# EAGLE design Sensor_HallArray (EAGLE 9.2.1)
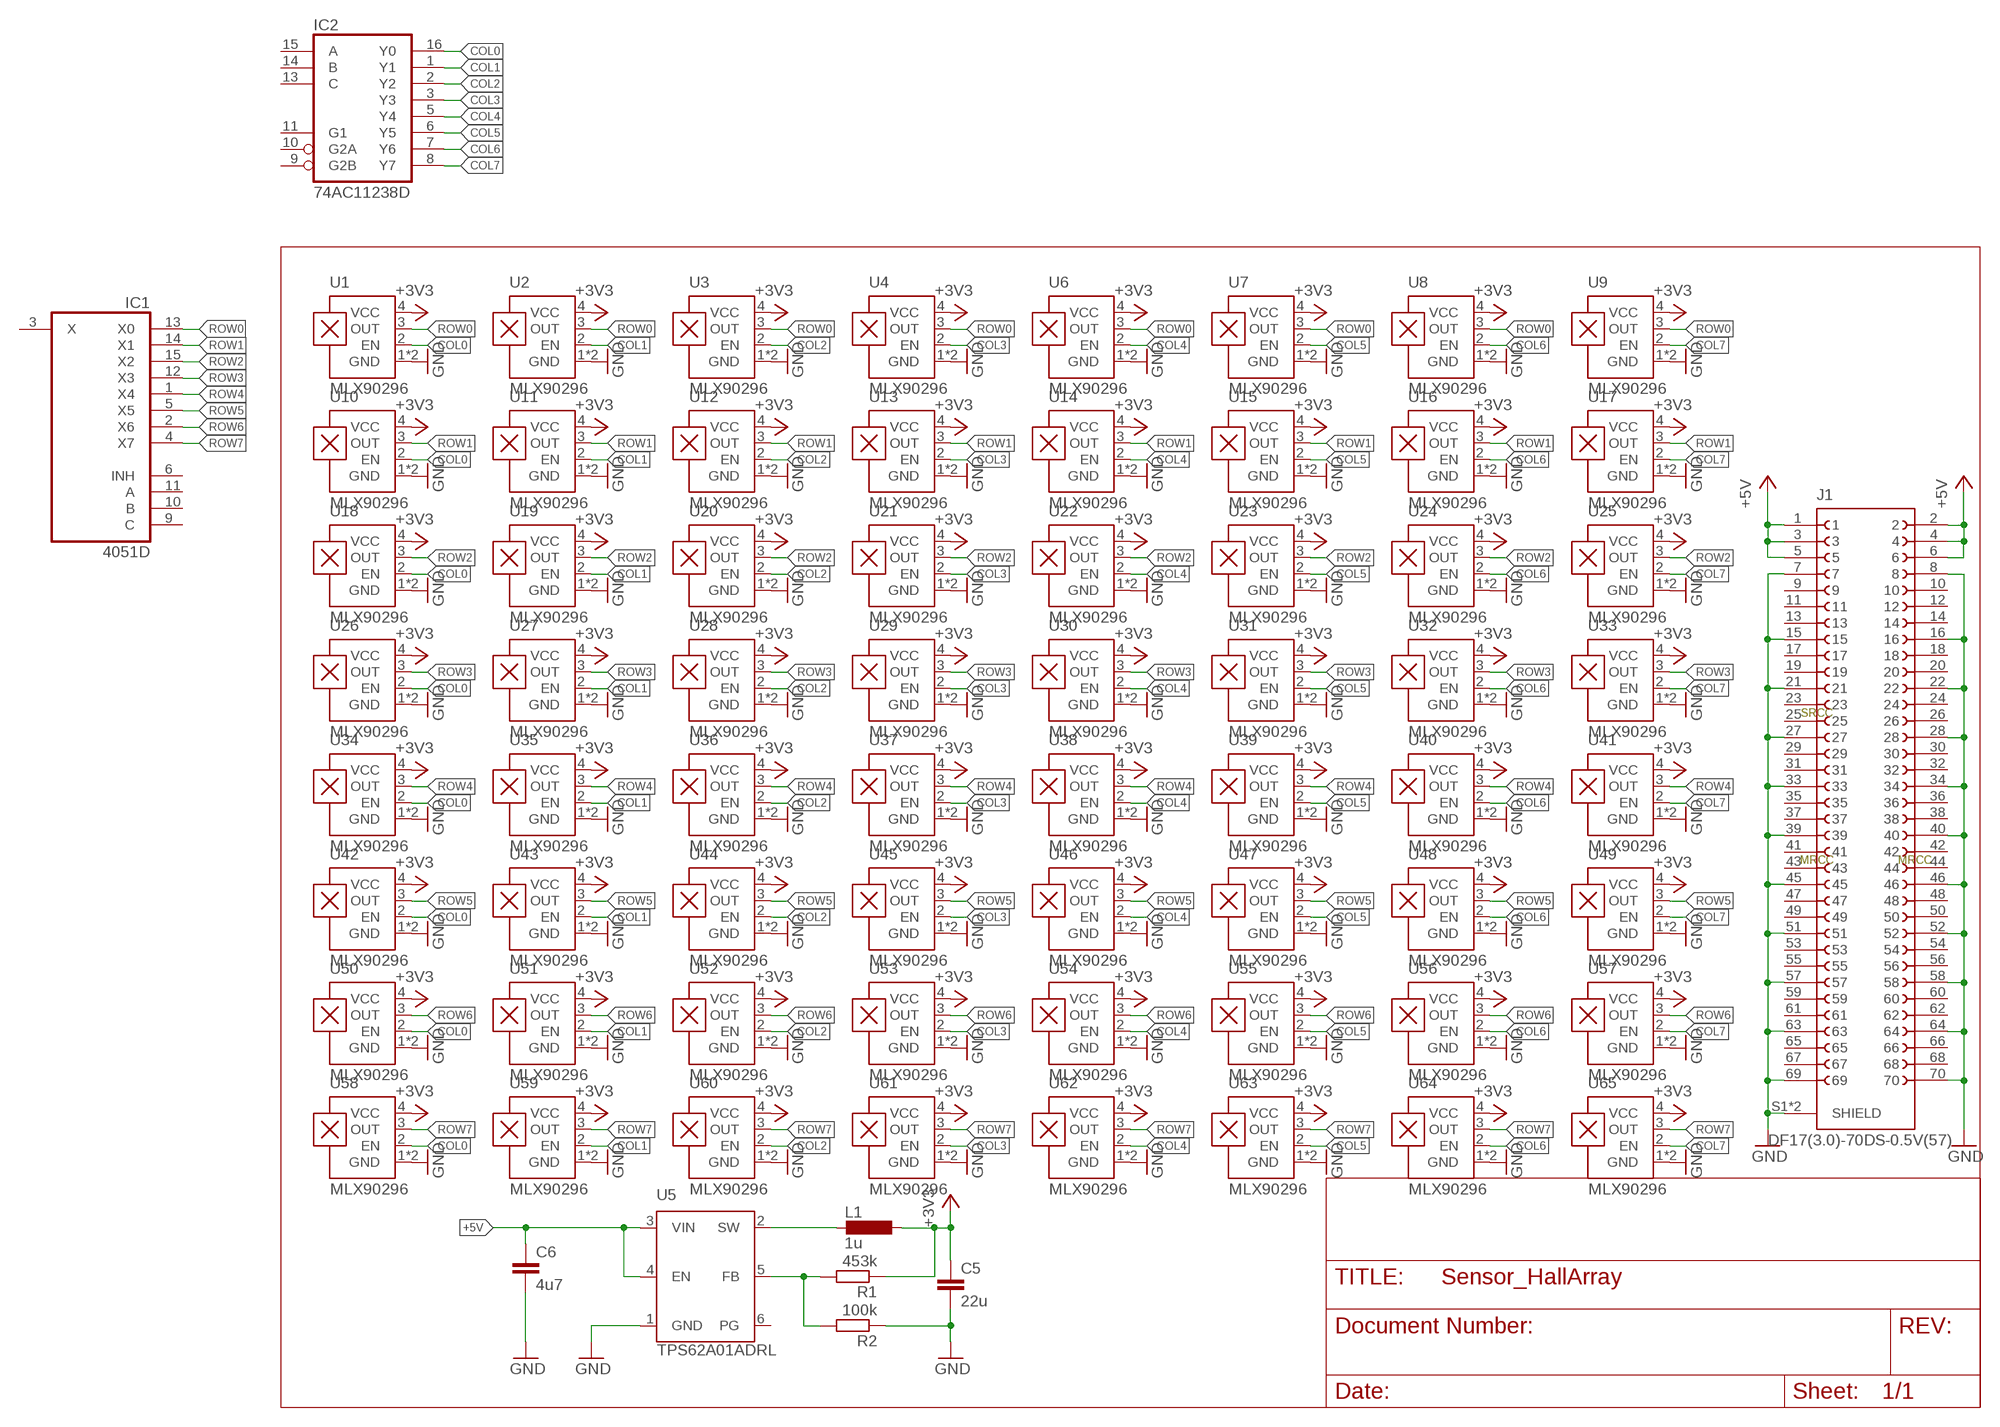
[diagram p0: schematic, sheet 1]

## Parts
C5  22u  C-EUC0603  [C0603]
C6  4u7  C-EUC0603  [C0603]
IC1  4051D  [SO16]
IC2  74AC11238D  [SO16]
J1  DF17(3.0)-70DS-0.5V(57)  [DF17(3.0)-70DS-0.5V(57)]
L1  1u  L-EU1008  [L1008]
R1  453k  R-EU_R0402  [R0402]
R2  100k  R-EU_R0402  [R0402]
U1  MLX90296  [DFN120X160X40-4]
U2  MLX90296  [DFN120X160X40-4]
U3  MLX90296  [DFN120X160X40-4]
U4  MLX90296  [DFN120X160X40-4]
U5  TPS62A01ADRL  [SOTFL50P160X60-6N]
U6  MLX90296  [DFN120X160X40-4]
U7  MLX90296  [DFN120X160X40-4]
U8  MLX90296  [DFN120X160X40-4]
U9  MLX90296  [DFN120X160X40-4]
U10  MLX90296  [DFN120X160X40-4]
U11  MLX90296  [DFN120X160X40-4]
U12  MLX90296  [DFN120X160X40-4]
U13  MLX90296  [DFN120X160X40-4]
U14  MLX90296  [DFN120X160X40-4]
U15  MLX90296  [DFN120X160X40-4]
U16  MLX90296  [DFN120X160X40-4]
U17  MLX90296  [DFN120X160X40-4]
U18  MLX90296  [DFN120X160X40-4]
U19  MLX90296  [DFN120X160X40-4]
U20  MLX90296  [DFN120X160X40-4]
U21  MLX90296  [DFN120X160X40-4]
U22  MLX90296  [DFN120X160X40-4]
U23  MLX90296  [DFN120X160X40-4]
U24  MLX90296  [DFN120X160X40-4]
U25  MLX90296  [DFN120X160X40-4]
U26  MLX90296  [DFN120X160X40-4]
U27  MLX90296  [DFN120X160X40-4]
U28  MLX90296  [DFN120X160X40-4]
U29  MLX90296  [DFN120X160X40-4]
U30  MLX90296  [DFN120X160X40-4]
U31  MLX90296  [DFN120X160X40-4]
U32  MLX90296  [DFN120X160X40-4]
U33  MLX90296  [DFN120X160X40-4]
U34  MLX90296  [DFN120X160X40-4]
U35  MLX90296  [DFN120X160X40-4]
U36  MLX90296  [DFN120X160X40-4]
U37  MLX90296  [DFN120X160X40-4]
U38  MLX90296  [DFN120X160X40-4]
U39  MLX90296  [DFN120X160X40-4]
U40  MLX90296  [DFN120X160X40-4]
U41  MLX90296  [DFN120X160X40-4]
U42  MLX90296  [DFN120X160X40-4]
U43  MLX90296  [DFN120X160X40-4]
U44  MLX90296  [DFN120X160X40-4]
U45  MLX90296  [DFN120X160X40-4]
U46  MLX90296  [DFN120X160X40-4]
U47  MLX90296  [DFN120X160X40-4]
U48  MLX90296  [DFN120X160X40-4]
U49  MLX90296  [DFN120X160X40-4]
U50  MLX90296  [DFN120X160X40-4]
U51  MLX90296  [DFN120X160X40-4]
U52  MLX90296  [DFN120X160X40-4]
U53  MLX90296  [DFN120X160X40-4]
U54  MLX90296  [DFN120X160X40-4]
U55  MLX90296  [DFN120X160X40-4]
U56  MLX90296  [DFN120X160X40-4]
U57  MLX90296  [DFN120X160X40-4]
U58  MLX90296  [DFN120X160X40-4]
U59  MLX90296  [DFN120X160X40-4]
U60  MLX90296  [DFN120X160X40-4]
U61  MLX90296  [DFN120X160X40-4]
U62  MLX90296  [DFN120X160X40-4]
U63  MLX90296  [DFN120X160X40-4]
U64  MLX90296  [DFN120X160X40-4]
U65  MLX90296  [DFN120X160X40-4]

## Nets
+3V3: C5.1 L1.1 R1.1 U1.4(VCC) U2.4(VCC) U3.4(VCC) U4.4(VCC) U6.4(VCC) U7.4(VCC) U8.4(VCC) U9.4(VCC) U10.4(VCC) U11.4(VCC) U12.4(VCC) U13.4(VCC) U14.4(VCC) U15.4(VCC) U16.4(VCC) U17.4(VCC) U18.4(VCC) U19.4(VCC) U20.4(VCC) U21.4(VCC) U22.4(VCC) U23.4(VCC) U24.4(VCC) U25.4(VCC) U26.4(VCC) U27.4(VCC) U28.4(VCC) U29.4(VCC) U30.4(VCC) U31.4(VCC) U32.4(VCC) U33.4(VCC) U34.4(VCC) U35.4(VCC) U36.4(VCC) U37.4(VCC) U38.4(VCC) U39.4(VCC) U40.4(VCC) U41.4(VCC) U42.4(VCC) U43.4(VCC) U44.4(VCC) U45.4(VCC) U46.4(VCC) U47.4(VCC) U48.4(VCC) U49.4(VCC) U50.4(VCC) U51.4(VCC) U52.4(VCC) U53.4(VCC) U54.4(VCC) U55.4(VCC) U56.4(VCC) U57.4(VCC) U58.4(VCC) U59.4(VCC) U60.4(VCC) U61.4(VCC) U62.4(VCC) U63.4(VCC) U64.4(VCC) U65.4(VCC)
+5V: C6.1 J1.1 J1.2 J1.3 J1.4 J1.5 J1.6 U5.3(VIN) U5.4(EN)
COL0: IC2.16(Y0) U1.2(EN) U10.2(EN) U18.2(EN) U26.2(EN) U34.2(EN) U42.2(EN) U50.2(EN) U58.2(EN)
COL1: IC2.1(Y1) U2.2(EN) U11.2(EN) U19.2(EN) U27.2(EN) U35.2(EN) U43.2(EN) U51.2(EN) U59.2(EN)
COL2: IC2.2(Y2) U3.2(EN) U12.2(EN) U20.2(EN) U28.2(EN) U36.2(EN) U44.2(EN) U52.2(EN) U60.2(EN)
COL3: IC2.3(Y3) U4.2(EN) U13.2(EN) U21.2(EN) U29.2(EN) U37.2(EN) U45.2(EN) U53.2(EN) U61.2(EN)
COL4: IC2.5(Y4) U6.2(EN) U14.2(EN) U22.2(EN) U30.2(EN) U38.2(EN) U46.2(EN) U54.2(EN) U62.2(EN)
COL5: IC2.6(Y5) U7.2(EN) U15.2(EN) U23.2(EN) U31.2(EN) U39.2(EN) U47.2(EN) U55.2(EN) U63.2(EN)
COL6: IC2.7(Y6) U8.2(EN) U16.2(EN) U24.2(EN) U32.2(EN) U40.2(EN) U48.2(EN) U56.2(EN) U64.2(EN)
COL7: IC2.8(Y7) U9.2(EN) U17.2(EN) U25.2(EN) U33.2(EN) U41.2(EN) U49.2(EN) U57.2(EN) U65.2(EN)
GND: C5.2 C6.2 J1.7 J1.8 J1.15 J1.16 J1.21 J1.22 J1.27 J1.28 J1.33 J1.34 J1.39 J1.40 J1.45 J1.46 J1.51 J1.52 J1.57 J1.58 J1.63 J1.64 J1.69 J1.70 J1.S1(SHIELD) J1.S2(SHIELD) R2.1 U1.1(GND) U1.E(GND) U2.1(GND) U2.E(GND) U3.1(GND) U3.E(GND) U4.1(GND) U4.E(GND) U5.1(GND) U6.1(GND) U6.E(GND) U7.1(GND) U7.E(GND) U8.1(GND) U8.E(GND) U9.1(GND) U9.E(GND) U10.1(GND) U10.E(GND) U11.1(GND) U11.E(GND) U12.1(GND) U12.E(GND) U13.1(GND) U13.E(GND) U14.1(GND) U14.E(GND) U15.1(GND) U15.E(GND) U16.1(GND) U16.E(GND) U17.1(GND) U17.E(GND) U18.1(GND) U18.E(GND) U19.1(GND) U19.E(GND) U20.1(GND) U20.E(GND) U21.1(GND) U21.E(GND) U22.1(GND) U22.E(GND) U23.1(GND) U23.E(GND) U24.1(GND) U24.E(GND) U25.1(GND) U25.E(GND) U26.1(GND) U26.E(GND) U27.1(GND) U27.E(GND) U28.1(GND) U28.E(GND) U29.1(GND) U29.E(GND) U30.1(GND) U30.E(GND) U31.1(GND) U31.E(GND) U32.1(GND) U32.E(GND) U33.1(GND) U33.E(GND) U34.1(GND) U34.E(GND) U35.1(GND) U35.E(GND) U36.1(GND) U36.E(GND) U37.1(GND) U37.E(GND) U38.1(GND) U38.E(GND) U39.1(GND) U39.E(GND) U40.1(GND) U40.E(GND) U41.1(GND) U41.E(GND) U42.1(GND) U42.E(GND) U43.1(GND) U43.E(GND) U44.1(GND) U44.E(GND) U45.1(GND) U45.E(GND) U46.1(GND) U46.E(GND) U47.1(GND) U47.E(GND) U48.1(GND) U48.E(GND) U49.1(GND) U49.E(GND) U50.1(GND) U50.E(GND) U51.1(GND) U51.E(GND) U52.1(GND) U52.E(GND) U53.1(GND) U53.E(GND) U54.1(GND) U54.E(GND) U55.1(GND) U55.E(GND) U56.1(GND) U56.E(GND) U57.1(GND) U57.E(GND) U58.1(GND) U58.E(GND) U59.1(GND) U59.E(GND) U60.1(GND) U60.E(GND) U61.1(GND) U61.E(GND) U62.1(GND) U62.E(GND) U63.1(GND) U63.E(GND) U64.1(GND) U64.E(GND) U65.1(GND) U65.E(GND)
N$00044: R1.2 R2.2 U5.5(FB)
N$50: L1.2 U5.2(SW)
ROW0: IC1.13(X0) U1.3(OUT) U2.3(OUT) U3.3(OUT) U4.3(OUT) U6.3(OUT) U7.3(OUT) U8.3(OUT) U9.3(OUT)
ROW1: IC1.14(X1) U10.3(OUT) U11.3(OUT) U12.3(OUT) U13.3(OUT) U14.3(OUT) U15.3(OUT) U16.3(OUT) U17.3(OUT)
ROW2: IC1.15(X2) U18.3(OUT) U19.3(OUT) U20.3(OUT) U21.3(OUT) U22.3(OUT) U23.3(OUT) U24.3(OUT) U25.3(OUT)
ROW3: IC1.12(X3) U26.3(OUT) U27.3(OUT) U28.3(OUT) U29.3(OUT) U30.3(OUT) U31.3(OUT) U32.3(OUT) U33.3(OUT)
ROW4: IC1.1(X4) U34.3(OUT) U35.3(OUT) U36.3(OUT) U37.3(OUT) U38.3(OUT) U39.3(OUT) U40.3(OUT) U41.3(OUT)
ROW5: IC1.5(X5) U42.3(OUT) U43.3(OUT) U44.3(OUT) U45.3(OUT) U46.3(OUT) U47.3(OUT) U48.3(OUT) U49.3(OUT)
ROW6: IC1.2(X6) U50.3(OUT) U51.3(OUT) U52.3(OUT) U53.3(OUT) U54.3(OUT) U55.3(OUT) U56.3(OUT) U57.3(OUT)
ROW7: IC1.4(X7) U58.3(OUT) U59.3(OUT) U60.3(OUT) U61.3(OUT) U62.3(OUT) U63.3(OUT) U64.3(OUT) U65.3(OUT)
Unconnected: IC1.3(X) IC1.6(INH) IC1.9(C) IC1.10(B) IC1.11(A) IC2.9(G2B) IC2.10(G2A) IC2.11(G1) IC2.13(C) IC2.14(B) IC2.15(A) J1.9 J1.10 J1.11 J1.12 J1.13 J1.14 J1.17 J1.18 J1.19 J1.20 J1.23 J1.24 J1.25 J1.26 J1.29 J1.30 J1.31 J1.32 J1.35 J1.36 J1.37 J1.38 J1.41 J1.42 J1.43 J1.44 J1.47 J1.48 J1.49 J1.50 J1.53 J1.54 J1.55 J1.56 J1.59 J1.60 J1.61 J1.62 J1.65 J1.66 J1.67 J1.68 U5.6(PG)

## Notes on the sheet
- SRCC
- MRCC | MRCC

## Power pins joined to a net without a drawn wire
GND: IC1.8(GND) IC2.4(GND)
VCC: IC1.16(VCC) IC2.12(VCC)
VEE: IC1.7(VEE)

## Library data of the parts
C5 = rcl:C-EU: CAPACITOR, European symbol; LCSC: C109448
C6 = rcl:C-EU: CAPACITOR, European symbol; LCSC: C19666
IC1 = 40xx:4051: 8-channel ANALOG MULTIPLEXER
IC2 = 74ac-logic:74AC11238: 3 to 8 line DECODER/DEMULTIPLEXER
J1 = Hirose:DF17(3.0)-70DS-0.5V(57)
L1 = rcl:L-EU: INDUCTOR, European symbol; DIGIKEY: 490-5112-1-ND; LCSC: C86091; MPN: LQM2HPN1R0MG0L
R1 = rcl:R-EU_: RESISTOR, European symbol; LCSC: C137978; SPICEPREFIX: R
R2 = rcl:R-EU_: RESISTOR, European symbol; DIGIKEY: RMCF0402FT100KCT-ND; LCSC: C60491; SPICEPREFIX: R
U1-U4 U6-U65 = Diodes_Inc:MLX90296: MLX90296 Micropower Linear Hall Sensor
U5 = TPS62A01DRLR:TPS62A01ADRL; DESCRIPTION: 2.5V-5.5V input, 1-A high efficiency step-down converter in 2x2 QFN or SOT563 package; DIGIKEY: 296-TPS62A01ADRLRCT-ND; HEIGHT: 0.6mm; LCSC: C5181455; MANUFACTURER_NAME: Texas Instruments; MANUFACTURER_PART_NUMBER: TPS62A01ADRLR; MOUSER: 595-TPS62A01ADRLR

## Board
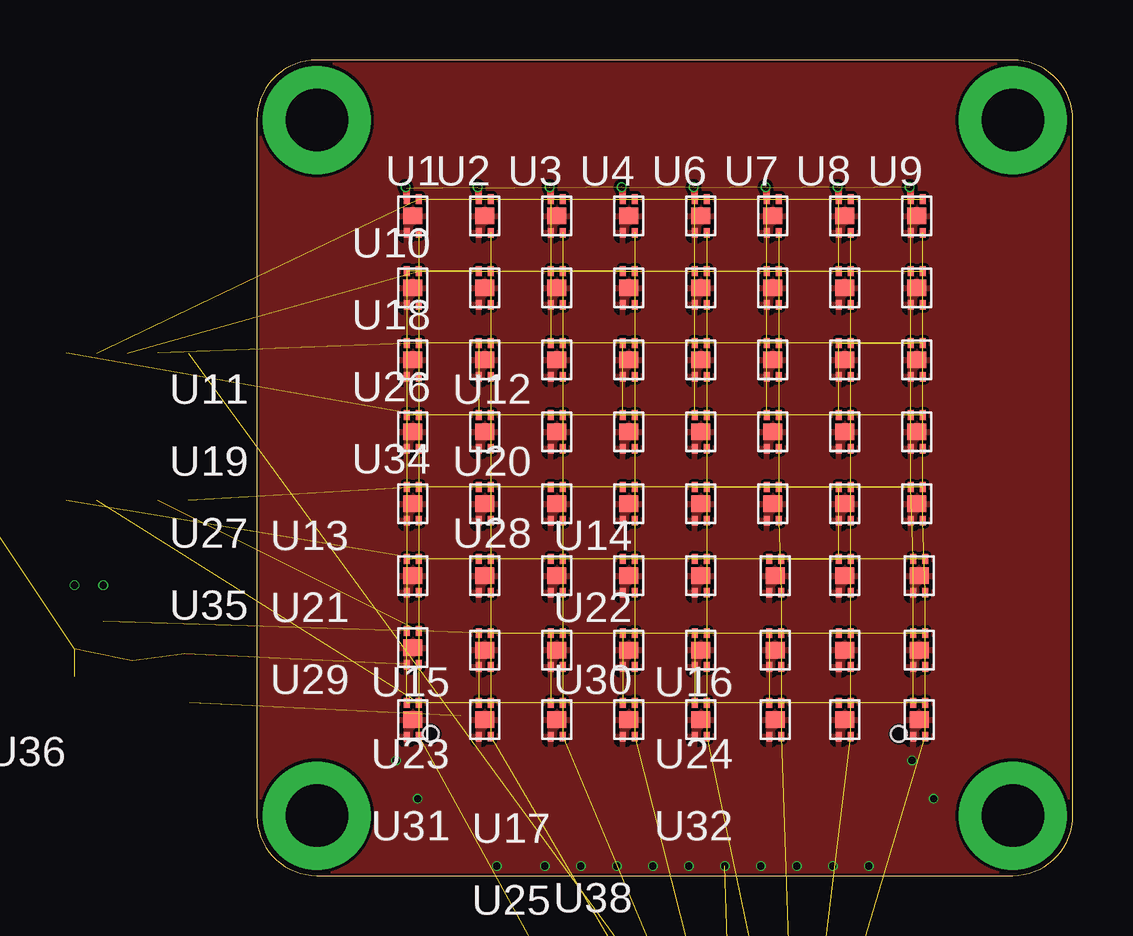
[diagram p1: board, top side]
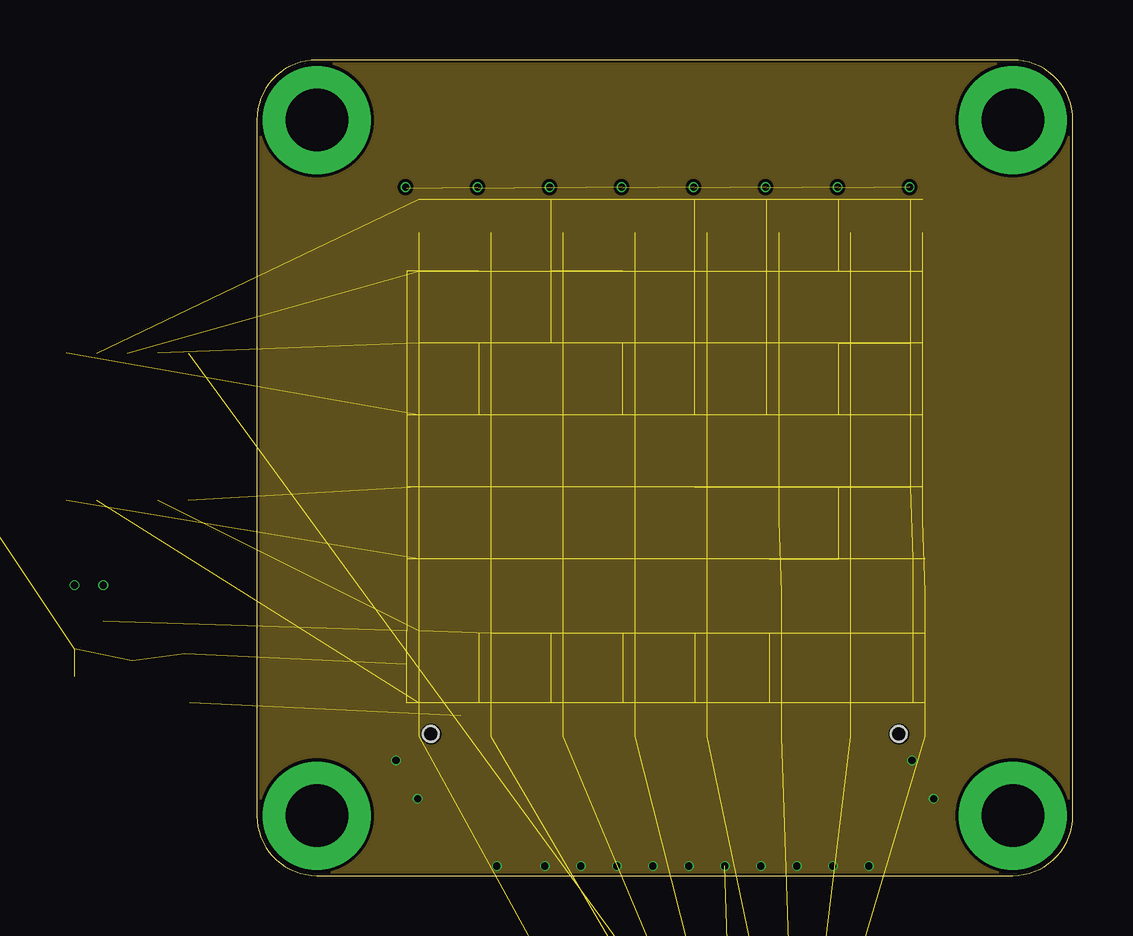
[diagram p2: board, inner layer Route2]
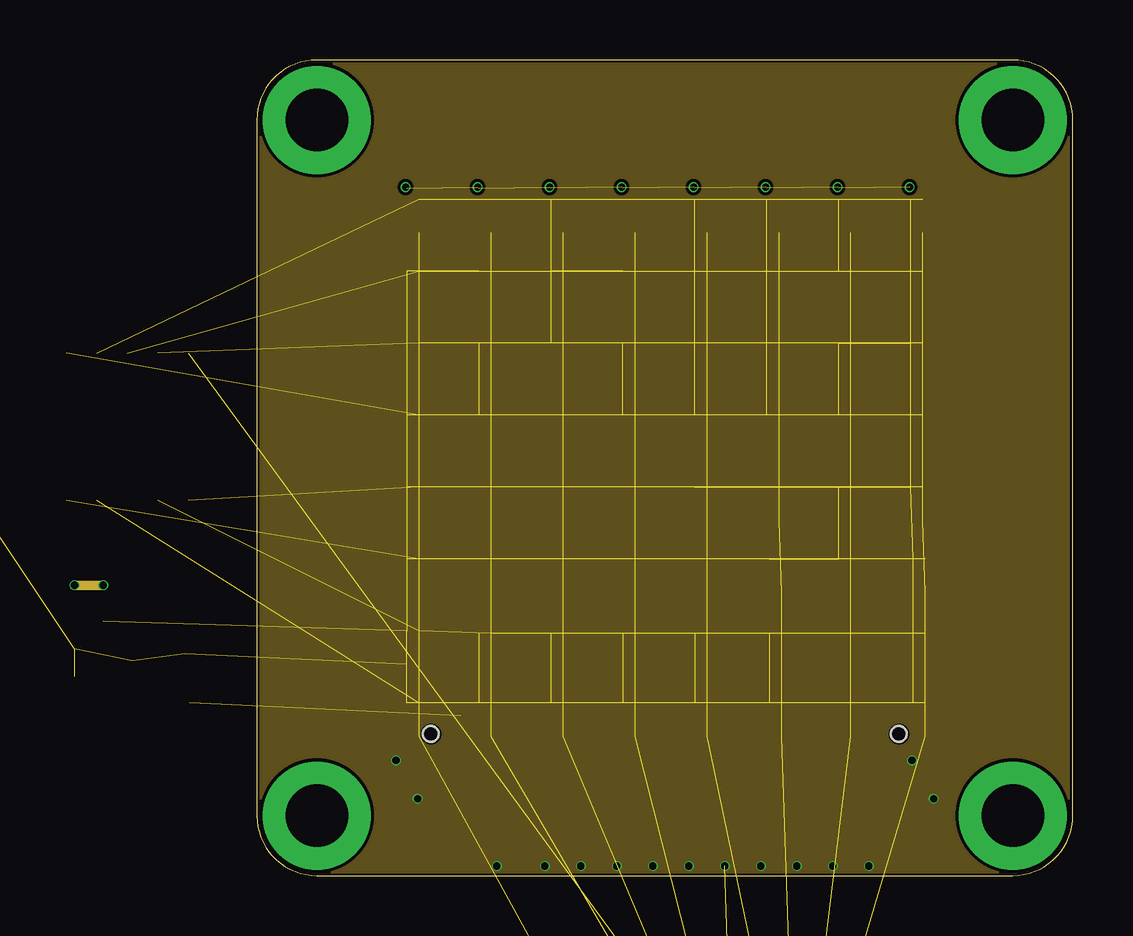
[diagram p3: board, inner layer Route15]
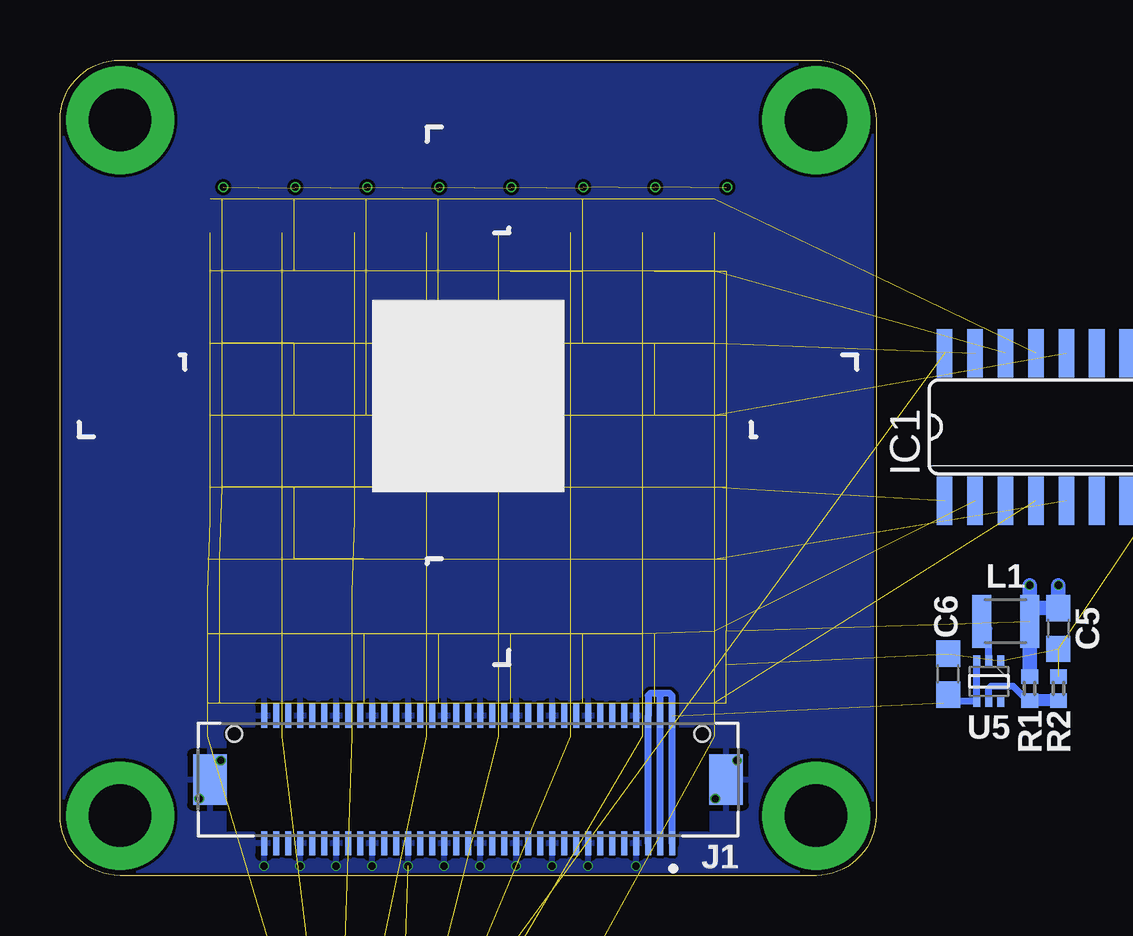
[diagram p4: board, bottom side, seen from below]

Size 34 x 34 mm. Coordinates in mm from the lower left corner, seen from the top.
Outline: 0,31.5 0,2.5 arc90 2.5,0 31.5,0 arc90 34,2.5 34,31.5 arc90 31.5,34 2.5,34 arc90 0,31.5
Copper layers (1*2*15*16): Top 0.035559375mm / dielectric 0.17018125mm / Route2 0.01778125mm / dielectric 47mil / Route15 0.01778125mm / dielectric 0.17018125mm / Bottom 0.035559375mm
Design rules "jlcpcb-4-layer *": minimum track width 5mil, minimum drill 0.2mm, track to track 5mil, track to pad 5mil, pad to pad 5mil, via to via 5mil, smd to smd 0mil, copper to edge 0.1mm, drill to drill 5mil, minimum pad ring 0.1mm, minimum via ring 0.05mm, stop-mask expansion 3mil, vias tented up to drill 100mil, thermal gap 10mil

### Footprints (pad centres in the part's own frame; a part is rotated, then mirrored left to right if it is on the bottom)
C0603 = smd 1.1 x 1: 1 -0.85,0; 2 0.85,0
SO16 = smd 0.66 x 2.032: 1 -4.445,-3.073; 2 -3.175,-3.073; 3 -1.905,-3.073; 4 -0.635,-3.073; 5 0.635,-3.073; 6 1.905,-3.073; 7 3.175,-3.073; 8 4.445,-3.073; 9 4.445,3.073; 10 3.175,3.073; 11 1.905,3.073; 12 0.635,3.073; 13 -0.635,3.073; 14 -1.905,3.073; 15 -3.175,3.073; 16 -4.445,3.073
DF17(3.0)-70DS-0.5V(57) = smd 0.25 x 1: 1 -8.5,2.65; 2 -8.5,-2.65; 3 -8,2.65; 4 -8,-2.65; 5 -7.5,2.65; 6 -7.5,-2.65; 7 -7,2.65; 8 -7,-2.65; 9 -6.5,2.65; 10 -6.5,-2.65; 11 -6,2.65; 12 -6,-2.65; 13 -5.5,2.65; 14 -5.5,-2.65; 15 -5,2.65; 16 -5,-2.65; 17 -4.5,2.65; 18 -4.5,-2.65; 19 -4,2.65; 20 -4,-2.65; 21 -3.5,2.65; 22 -3.5,-2.65; 23 -3,2.65; 24 -3,-2.65; 25 -2.5,2.65; 26 -2.5,-2.65; 27 -2,2.65; 28 -2,-2.65; 29 -1.5,2.65; 30 -1.5,-2.65; 31 -1,2.65; 32 -1,-2.65; 33 -0.5,2.65; 34 -0.5,-2.65; 35 0,2.65; 36 0,-2.65; 37 0.5,2.65; 38 0.5,-2.65; 39 1,2.65; 40 1,-2.65; 41 1.5,2.65; 42 1.5,-2.65; 43 2,2.65; 44 2,-2.65; 45 2.5,2.65; 46 2.5,-2.65; 47 3,2.65; 48 3,-2.65; 49 3.5,2.65; 50 3.5,-2.65; 51 4,2.65; 52 4,-2.65; 53 4.5,2.65; 54 4.5,-2.65; 55 5,2.65; 56 5,-2.65; 57 5.5,2.65; 58 5.5,-2.65; 59 6,2.65; 60 6,-2.65; 61 6.5,2.65; 62 6.5,-2.65; 63 7,2.65; 64 7,-2.65; 65 7.5,2.65; 66 7.5,-2.65; 67 8,2.65; 68 8,-2.65; 69 8.5,2.65; 70 8.5,-2.65 | smd 1.4 x 2.1: S1 -10.75,0; S2 10.75,0 | hole 0.65: -9.75,-1.9; 9.75,-1.9
L1008 = smd 0.8 x 2.2: 1 -1,0; 2 1,0
R0402 = smd 0.6 x 0.7: 1 -0.5,0; 2 0.5,0
DFN120X160X40-4 = smd 0.25 x 0.4: 1 -0.25,-0.7; 2 0.25,-0.7; 3 0.25,0.7; 4 -0.25,0.7 | smd 0.8 x 0.7: E 0,0
SOTFL50P160X60-6N = smd 0.475 x 0.3: 1 -0.838,0.5; 2 -0.838,0; 3 -0.838,-0.5; 4 0.838,-0.5; 5 0.838,0; 6 0.838,0.5

### Placement (x,y rotation side)
C5  -7.6,10.3 270 bottom  (outside the outline)
C6  -3,8.4 90 bottom
IC1  -7.3,18.7 0 bottom
IC2  20.3,-7.7 180 bottom  (outside the outline)
J1  17,4 180 bottom
L1  -5.4,10.6 180 bottom  (outside the outline)
R1  -6.4,7.8 270 bottom  (outside the outline)
R2  -7.6,7.8 270 bottom  (outside the outline)
U1  6.5,27.5 0 top
U2  9.5,27.5 0 top
U3  12.5,27.5 0 top
U4  15.5,27.5 0 top
U5  -4.7,8.1 270 bottom  (outside the outline)
U6  18.5,27.5 0 top
U7  21.5,27.5 0 top
U8  24.5,27.5 0 top
U9  27.5,27.5 0 top
U10  6.5,24.5 0 top
U11  9.5,24.5 0 top
U12  12.5,24.5 0 top
U13  15.5,24.5 0 top
U14  18.5,24.5 0 top
U15  21.5,24.5 0 top
U16  24.5,24.5 0 top
U17  27.5,24.5 0 top
U18  6.5,21.5 0 top
U19  9.5,21.5 0 top
U20  12.5,21.5 0 top
U21  15.5,21.5 0 top
U22  18.5,21.5 0 top
U23  21.5,21.5 0 top
U24  24.5,21.5 0 top
U25  27.5,21.5 0 top
U26  6.5,18.5 0 top
U27  9.5,18.5 0 top
U28  12.5,18.5 0 top
U29  15.5,18.5 0 top
U30  18.5,18.5 0 top
U31  21.5,18.5 0 top
U32  24.5,18.5 0 top
U33  27.5,18.5 0 top
U34  6.5,15.5 0 top
U35  9.5,15.5 0 top
U36  12.5,15.5 0 top
U37  15.5,15.5 0 top
U38  18.5,15.5 0 top
U39  21.5,15.5 0 top
U40  24.5,15.5 0 top
U41  27.5,15.5 0 top
U42  6.5,12.5 0 top
U43  9.5,12.5 0 top
U44  12.5,12.5 0 top
U45  15.5,12.5 0 top
U46  18.5,12.5 0 top
U47  21.6,12.5 0 top
U48  24.5,12.5 0 top
U49  27.6,12.5 0 top
U50  6.5,9.5 0 top
U51  9.5,9.4 0 top
U52  12.5,9.4 0 top
U53  15.5,9.4 0 top
U54  18.5,9.4 0 top
U55  21.6,9.4 0 top
U56  24.5,9.4 0 top
U57  27.6,9.4 0 top
U58  6.5,6.5 0 top
U59  9.5,6.5 0 top
U60  12.5,6.5 0 top
U61  15.5,6.5 0 top
U62  18.5,6.5 0 top
U63  21.6,6.5 0 top
U64  24.5,6.5 0 top
U65  27.6,6.5 0 top

### Tracks (layer width: path | path; a pad name or v marks a point on that pad's centre or on a via)
+3V3  (via drill 0.3)  (64 unrouted)
  Top 0.3: U1.4 6.25,28.65 v6.2,28.7 | U9.4 27.25,28.65 v27.2,28.7 | U8.4 24.25,28.65 v24.2,28.7 | U7.4 21.25,28.65 v21.2,28.7 | U6.4 18.25,28.65 v18.2,28.7 | U4.4 15.25,28.65 v15.2,28.7 | U3.4 12.25,28.65 v12.2,28.7 | U2.4 9.25,28.65 v9.2,28.7
  Route15 0.4: v-6.4,12.1 v-7.6,12.1
  Bottom 0.5: -6.45,11.15 -6.4,11.2 L1.1
  Bottom 0.6: R1.1 L1.1 v-6.4,12.1 | -6.45,11.15 C5.1 v-7.6,12.1
+5V  (1 unrouted)
  Bottom 0.2: -2.8,7.2 -3.07,7.47
  Bottom 0.3: J1.1 J1.2 8.5,7.5 8.6,7.6 9,7.6 | J1.3 J1.4 9,7.6 | J1.5 J1.6 9.5,7.5 9.4,7.6 9,7.6 | C6.1 -3.07,7.47 -3.29,7.26 U5.4 U5.3
COL0  (8 unrouted)
COL1  (8 unrouted)
COL2  (8 unrouted)
COL3  (8 unrouted)
COL4  (8 unrouted)
COL5  (8 unrouted)
COL6  (8 unrouted)
COL7  (8 unrouted)
GND  (via drill 0.3)  (6 unrouted)
  other vias: 15,0.4 16.5,0.4 18,0.4 19.5,0.4 21,0.4 22.5,0.4 24,0.4 5.8,4.8 6.7,3.2 27.3,4.8 28.2,3.2 10,0.4 12,0.4 13.5,0.4 25.5,0.4
  pour Top: 0,0 34,0 34,34 0,34
  pour Bottom: 0,0 34,0 34,34 0,34
  pour Route2: 0,0 34,0 34,34 0,34
  pour Route15: 0,0 34,0 34,34 0,34
N$00025  (via drill 2.6 pad 4.5)
  other vias: 2.5,31.5
N$00026  (via drill 2.6 pad 4.5)
  other vias: 31.5,31.5
N$00027  (via drill 2.6 pad 4.5)
  other vias: 2.5,2.5
N$00028  (via drill 2.6 pad 4.5)
  other vias: 31.5,2.5
N$00044
  Bottom 0.3: U5.5 -4.7,7.8 -4.8,7.9 -5.7,7.9 -6.3,7.3 R1.2
  Bottom 0.5: R2.2 R1.2
N$50
  Bottom 0.2: -4.7,10.3 L1.2
  Bottom 0.3: U5.2 -4.7,10.3
ROW0  (8 unrouted)
ROW1  (8 unrouted)
ROW2  (8 unrouted)
ROW3  (8 unrouted)
ROW4  (8 unrouted)
ROW5  (8 unrouted)
ROW6  (8 unrouted)
ROW7  (8 unrouted)
VCC  (1 unrouted)